# EAGLE design Cockpit-shield (EAGLE 9.5.2)
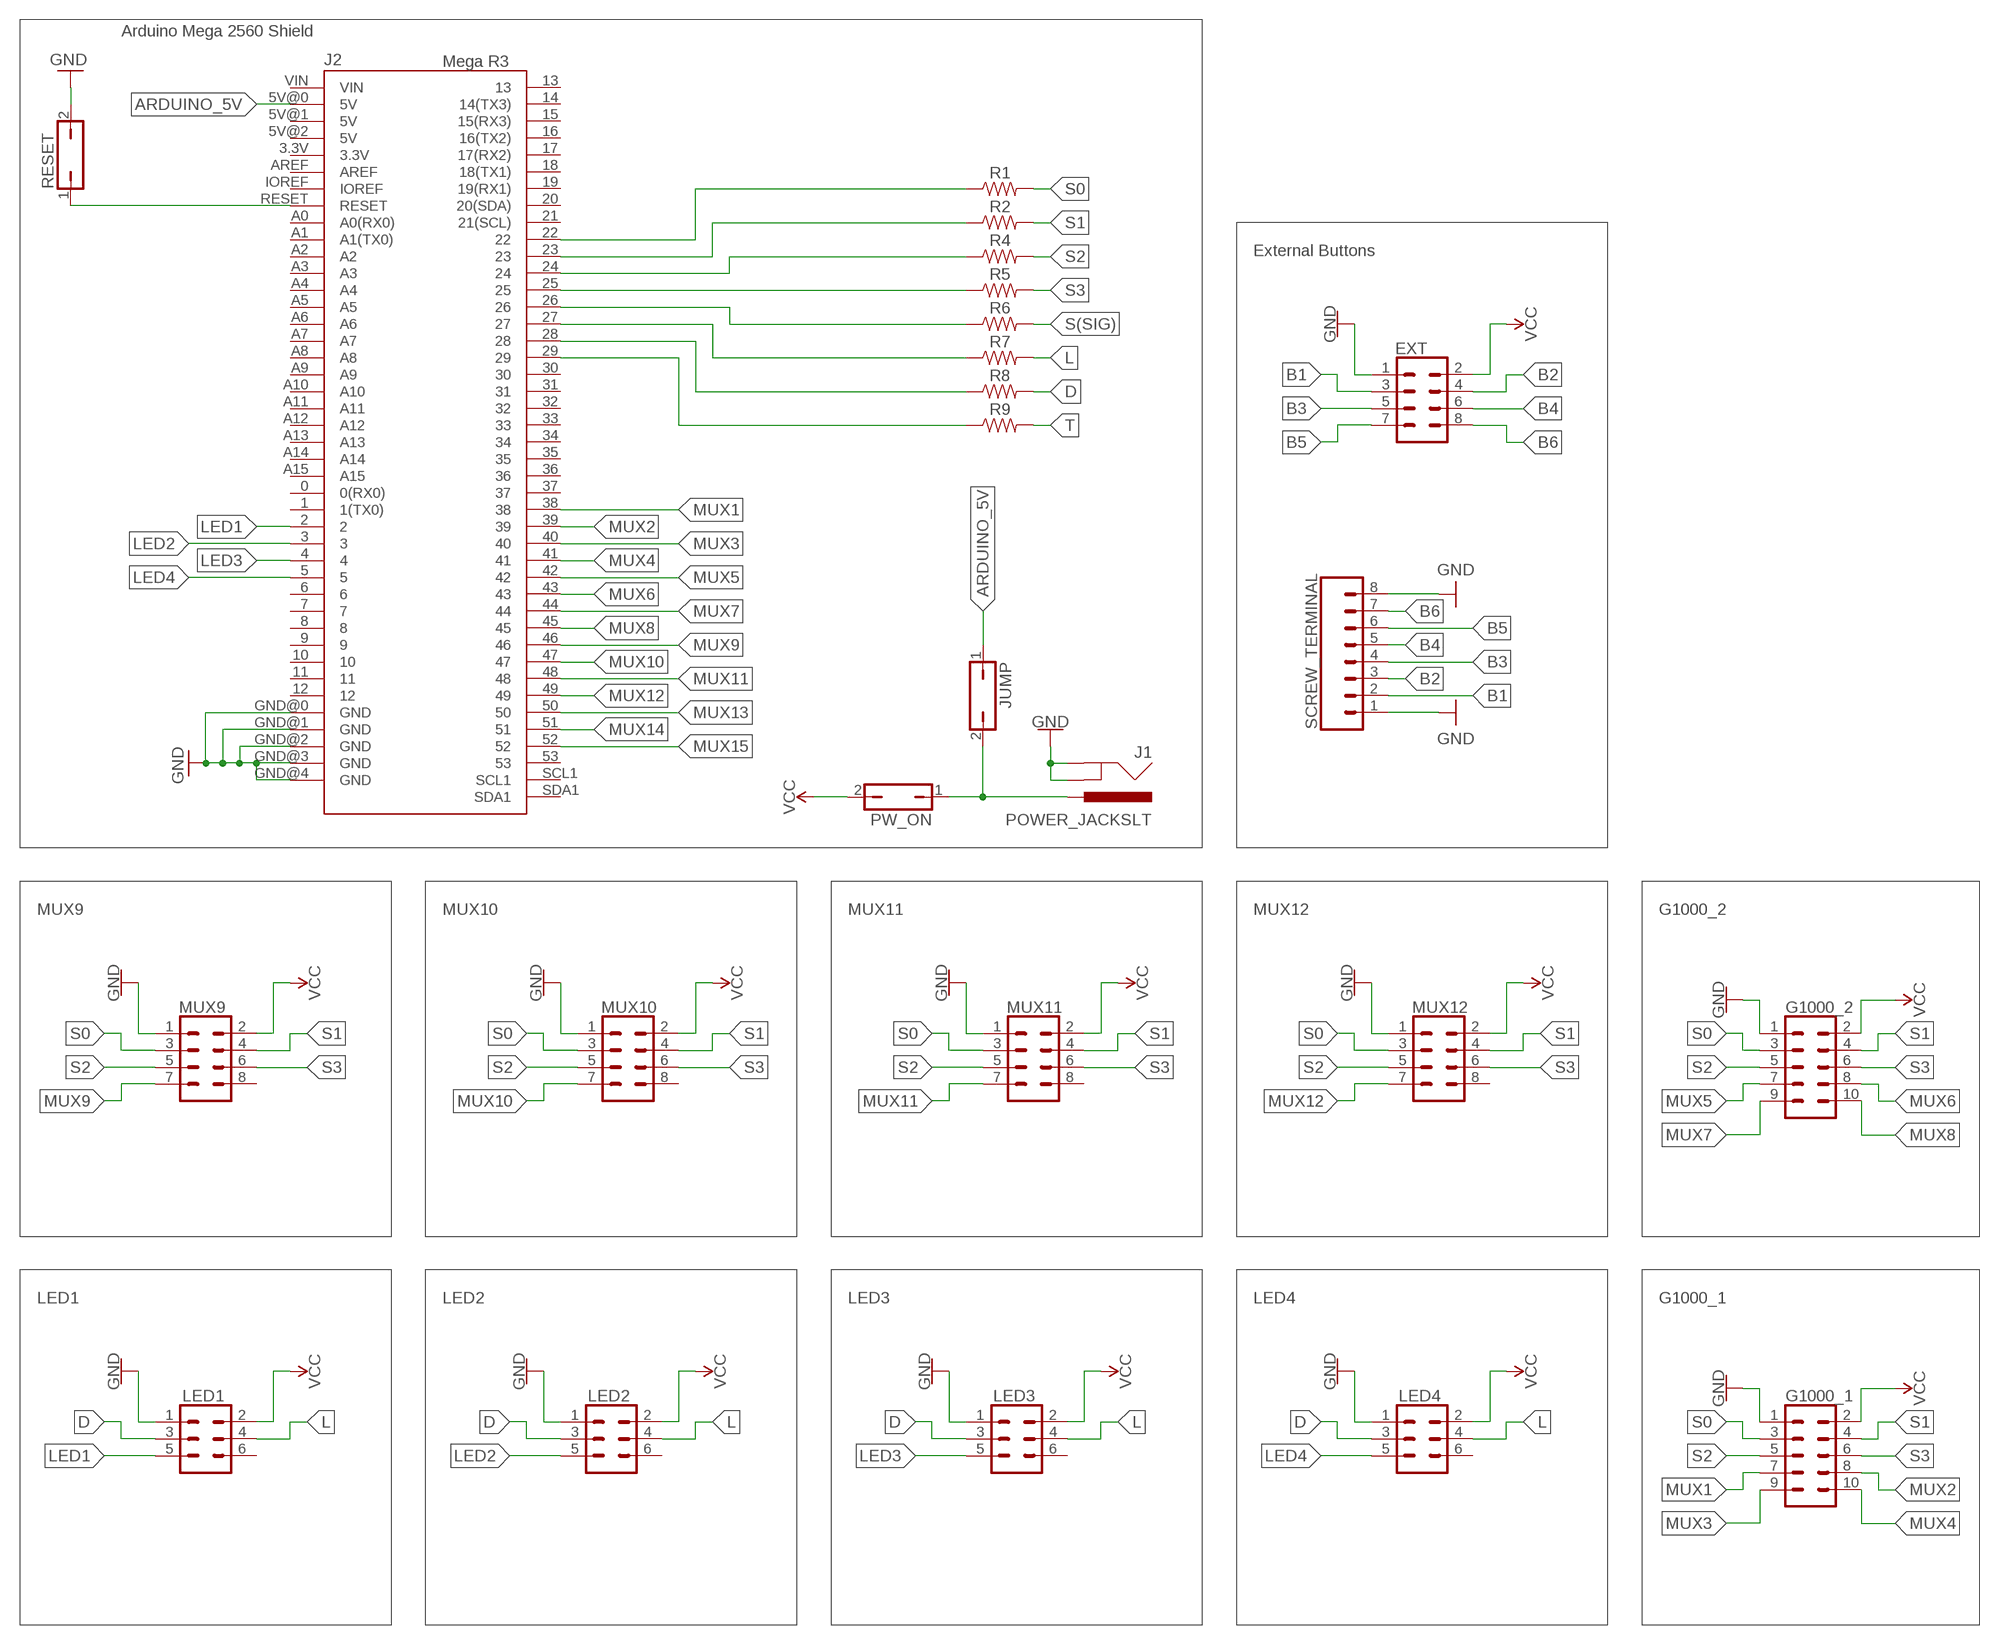
[diagram p0: schematic, sheet 1]

## Parts
EXT  CONN_04X2  [2X4]
G1000_1  CONN_05X2SHD-NS  [2X5-SHROUDED-NS]
G1000_2  CONN_05X2SHD-NS  [2X5-SHROUDED-NS]
J1  POWER_JACKSLT  [POWER_JACK_SLOT]
J2  Mega R3  ARDUINO-MEGAFULL  [ARDUINO_MEGA]
JUMP  JP1Q  [JP1]
LED1  CONN_03X2NO_SILK  [2X3-NS]
LED2  CONN_03X2NO_SILK  [2X3-NS]
LED3  CONN_03X2NO_SILK  [2X3-NS]
LED4  CONN_03X2NO_SILK  [2X3-NS]
MUX9  CONN_04X2  [2X4]
MUX10  CONN_04X2  [2X4]
MUX11  CONN_04X2  [2X4]
MUX12  CONN_04X2  [2X4]
PW_ON  JP1Q  [JP1]
R1  RESISTOR1206  [1206]
R2  RESISTOR1206  [1206]
R4  RESISTOR1206  [1206]
R5  RESISTOR1206  [1206]
R6  RESISTOR1206  [1206]
R7  RESISTOR1206  [1206]
R8  RESISTOR1206  [1206]
R9  RESISTOR1206  [1206]
RESET  JP1Q  [JP1]
SCREW_TERMINAL  CONN_083.5MM-8  [SCREWTERMINAL-3.5MM-8]

## Nets
ARDUINO_5V: J2.5V@0(5V) JUMP.1
B1: EXT.3 SCREW_TERMINAL.2
B2: EXT.4 SCREW_TERMINAL.3
B3: EXT.5 SCREW_TERMINAL.4
B4: EXT.6 SCREW_TERMINAL.5
B5: EXT.7 SCREW_TERMINAL.6
B6: EXT.8 SCREW_TERMINAL.7
D: LED1.3 LED2.3 LED3.3 LED4.3 R8.2
GND: EXT.1 G1000_1.1 G1000_2.1 J1.GND@1(GNDBREAK) J1.GND@2(GND) J2.GND@0(GND) J2.GND@1(GND) J2.GND@2(GND) J2.GND@3(GND) J2.GND@4(GND) LED1.1 LED2.1 LED3.1 LED4.1 MUX9.1 MUX10.1 MUX11.1 MUX12.1 RESET.2 SCREW_TERMINAL.1 SCREW_TERMINAL.8
L: LED1.4 LED2.4 LED3.4 LED4.4 R7.2
LED1: J2.2 LED1.5
LED2: J2.3 LED2.5
LED3: J2.4 LED3.5
LED4: J2.5 LED4.5
MUX1: G1000_1.7 J2.38
MUX2: G1000_1.8 J2.39
MUX3: G1000_1.9 J2.40
MUX4: G1000_1.10 J2.41
MUX5: G1000_2.7 J2.42
MUX6: G1000_2.8 J2.43
MUX7: G1000_2.9 J2.44
MUX8: G1000_2.10 J2.45
MUX9: J2.46 MUX9.7
MUX10: J2.47 MUX10.7
MUX11: J2.48 MUX11.7
MUX12: J2.49 MUX12.7
MUX13: J2.50
MUX14: J2.51
MUX15: J2.52
N$1: J2.22 R1.1
N$2: J2.23 R2.1
N$3: J2.24 R4.1
N$4: J2.25 R5.1
N$5: J2.26 R6.1
N$6: J2.27 R7.1
N$7: J2.28 R8.1
N$8: J2.29 R9.1
N$10: J1.PWR JUMP.2 PW_ON.1
RESET: J2.RESET RESET.1
S0: G1000_1.3 G1000_2.3 MUX9.3 MUX10.3 MUX11.3 MUX12.3 R1.2
S1: G1000_1.4 G1000_2.4 MUX9.4 MUX10.4 MUX11.4 MUX12.4 R2.2
S2: G1000_1.5 G1000_2.5 MUX9.5 MUX10.5 MUX11.5 MUX12.5 R4.2
S3: G1000_1.6 G1000_2.6 MUX9.6 MUX10.6 MUX11.6 MUX12.6 R5.2
S(SIG): R6.2
T: R9.2
VCC: EXT.2 G1000_1.2 G1000_2.2 LED1.2 LED2.2 LED3.2 LED4.2 MUX9.2 MUX10.2 MUX11.2 MUX12.2 PW_ON.2
Unconnected: J2.0(0(RX0)) J2.1(1(TX0)) J2.3.3V J2.5V@1(5V) J2.5V@2(5V) J2.6 J2.7 J2.8 J2.9 J2.10 J2.11 J2.12 J2.13 J2.14(14(TX3)) J2.15(15(RX3)) J2.16(16(TX2)) J2.17(17(RX2)) J2.18(18(TX1)) J2.19(19(RX1)) J2.20(20(SDA)) J2.21(21(SCL)) J2.30 J2.31 J2.32 J2.33 J2.34 J2.35 J2.36 J2.37 J2.53 J2.A0(A0(RX0)) J2.A1(A1(TX0)) J2.A2 J2.A3 J2.A4 J2.A5 J2.A6 J2.A7 J2.A8 J2.A9 J2.A10 J2.A11 J2.A12 J2.A13 J2.A14 J2.A15 J2.AREF J2.IOREF J2.SCL1 J2.SDA1 J2.VIN LED1.6 LED2.6 LED3.6 LED4.6 MUX9.8 MUX10.8 MUX11.8 MUX12.8

## Notes on the sheet
- Arduino Mega 2560 Shield
- External Buttons
- MUX9 | MUX10 | MUX11 | MUX12 | G1000_2
- LED1 | LED2 | LED3 | LED4 | G1000_1

## Library data of the parts
EXT MUX9-MUX12 = SparkFun-Connectors:CONN_04X2: Multi connection point. Often used as Generic Header-pin footprint for 0.1 inch spaced/style header connections On any of the 0.1 inch spaced packages, you can populate with these: Break Away Headers - Straight <https://www.sparkfun.com/products/116> (PRT-00116) Break Away Male Headers - Right Angle <https://www.sparkfun.com/products/553> (PRT-00553) Female Headers <https://www.sparkfun.com/products/115> (PRT-00115) Break Away Headers - Machine Pin <https://www.sparkfun.com/products/117> (PRT-00117) Break Away Female Headers - Swiss Machine Pin <https://www.sparkfun.com/products/743> (PRT-00743)
G1000_1 G1000_2 = SparkFun-Connectors:CONN_05X2: Multi connection point. Often used as Generic Header-pin footprint for 0.1 inch spaced/style header connections For AVR SPI programming port, see special device with nice symbol: "AVR_SPI_PROG_5x2.dev" You can populate with any combo of single row headers, but if you'd like an exact match, check these: 2x5 AVR ICSP Male Header <https://www.sparkfun.com/products/778> (PRT-00778) 2x5 Pin Shrouded Header <https://www.sparkfun.com/products/8506> (PRT-08506) On any of the 0.1 inch spaced packages, you can populate with these: Break Away Headers - Straight <https://www.sparkfun.com/products/116> (PRT-00116) Break Away Male Headers - Right Angle <https://www.sparkfun.com/products/553> (PRT-00553) Female Headers <https://www.sparkfun.com/products/115> (PRT-00115) Break Away Headers - Machine Pin <https://www.sparkfun.com/products/117> (PRT-00117) Break Away Female Headers - Swiss Machine Pin <https://www.sparkfun.com/products/743> (PRT-00743) Special note: the shrouded connector mates well with our 5x2 ribbon cables: 2x5 Pin IDC Ribbon Cable <https://www.sparkfun.com/products/8535> (PRT-08535); PROD_ID: CONN-08671; SF_ID: PRT-08506
J1 = SparkFun-Connectors:POWER_JACK: Power Jack Connector This is the standard 5.5mm barrel jack for power. The PTH is the most common, proven, reliable, footprint. The Slot footprint only works if the mill layer is transmitted to the PCB fab house so be warned. Here are the connectors we sell at SparkFun: DC Barrel Power Jack/Connector <https://www.sparkfun.com/products/119> (PRT-00119) DC Barrel Power Jack/Connector (SMD) <https://www.sparkfun.com/products/12748> (PRT-12748) DC Barrel Jack Adapter - Breadboard Compatible <https://www.sparkfun.com/products/10811> (PRT-10811) It is used on this SparkFun product (and many, many others): SparkFun RedBoard - Programmed with Arduino <https://www.sparkfun.com/products/12757> (DEV-12757) Also, if you need a mating power supply or connector, please check these out: Wall Adapter Power Supply - 9VDC 650mA <https://www.sparkfun.com/products/298> (TOL-00298) DC Barrel Jack Adapter - Male <https://www.sparkfun.com/products/10287> (PRT-10287); PROD_ID: PRT-00119
J2 = zortness:ARDUINO-MEGA: Arduino MegaR3 board footprint. Also works for Due.
JUMP PW_ON RESET = jumper:JP1Q: JUMPER
LED1-LED4 = SparkFun-Connectors:CONN_03X2: Multi connection point. Often used as Generic Header-pin footprint for 0.1 inch spaced/style header connections You can populate with any combo of single row headers, but if you'd like an exact match, check these: Header - 2x3 (Male, 0.1") <https://www.sparkfun.com/products/12807> (PRT-12807) Header - 2x3 (Female, 0.1") <https://www.sparkfun.com/products/13010> (PRT-13010) 2x3 Pin Shrouded Header <https://www.sparkfun.com/products/10877> (PRT-10877) On any of the 0.1 inch spaced packages, you can populate with these: Break Away Headers - Straight <https://www.sparkfun.com/products/116> (PRT-00116) Break Away Male Headers - Right Angle <https://www.sparkfun.com/products/553> (PRT-00553) Female Headers <https://www.sparkfun.com/products/115> (PRT-00115) Break Away Headers - Machine Pin <https://www.sparkfun.com/products/117> (PRT-00117) Break Away Female Headers - Swiss Machine Pin <https://www.sparkfun.com/products/743> (PRT-00743) Special note: the shrouded connector mates well with our 3x2 ribbon cables: Ribbon Crimp Connector - 6-pin (2x3, Female) <https://www.sparkfun.com/products/10651> (PRT-10651) Ribbon Cable - 6 wire (15ft) <https://www.sparkfun.com/products/10646> (PRT-10646)
R1 R2 R4-R9 = SparkFun-Resistors:RESISTOR: Generic Resistor Package
SCREW_TERMINAL = SparkFun-Connectors:CONN_08: Multi connection point. Often used as Generic Header-pin footprint for 0.1 inch spaced/style header connections On any of the 0.1 inch spaced packages, you can populate with these: Break Away Headers - Straight <https://www.sparkfun.com/products/116> (PRT-00116) Break Away Male Headers - Right Angle <https://www.sparkfun.com/products/553> (PRT-00553) Female Headers <https://www.sparkfun.com/products/115> (PRT-00115) Break Away Headers - Machine Pin <https://www.sparkfun.com/products/117> (PRT-00117) Break Away Female Headers - Swiss Machine Pin <https://www.sparkfun.com/products/743> (PRT-00743) Arduino Stackable Header - 8 Pin <https://www.sparkfun.com/products/9279> (PRT-09279) For SCREWTERMINALS and SPRING TERMINALS visit here: Screw Terimnals on SparkFun.com <https://www.sparkfun.com/search/results?term=Screw+Terminals> (5mm/3.5mm/2.54mm spacing) This device is also useful as a general connection point to wire up your design to another part of your project. Our various solder wires solder well into these plated through hole pads. Hook-Up Wire - Assortment (Stranded, 22 AWG) <https://www.sparkfun.com/products/11375> (PRT-11375) Hook-Up Wire - Assortment (Solid Core, 22 AWG) <https://www.sparkfun.com/products/11367> (PRT-11367) View the entire wire category on our website here <https://www.sparkfun.com/categories/141> Special notes: Molex polarized connector foot print use with SKU : PRT-08231 with associated crimp pins and housings. 1MM SMD Version SKU: PRT-10208 NOTES ON THE VARIANTS LOCK and LOCK_LONGPADS... This footprint was designed to help hold the alignment of a through-hole component (i.e. 6-pin header) while soldering it into place. You may notice that each hole has been shifted either up or down by 0.005 of an inch from it's more standard position (which is a perfectly straight line). This slight alteration caused the pins (the squares in the middle) to touch the edges of the holes. Because they are alternating, it causes a "brace" to hold the component in place. 0.005 has proven to be the perfect amount of "off-center" position when using our standard breakaway headers. Although looks a little odd when you look at the bare footprint, once you have a header in there, the alteration is very hard to notice. Also,if you push a header all the way into place, it is covered up entirely on the bottom side.

## Net classes
0 default: clearance 0.205 mm
1 pwr: width 0.305 mm
2 raw: width 0.305 mm

## Board
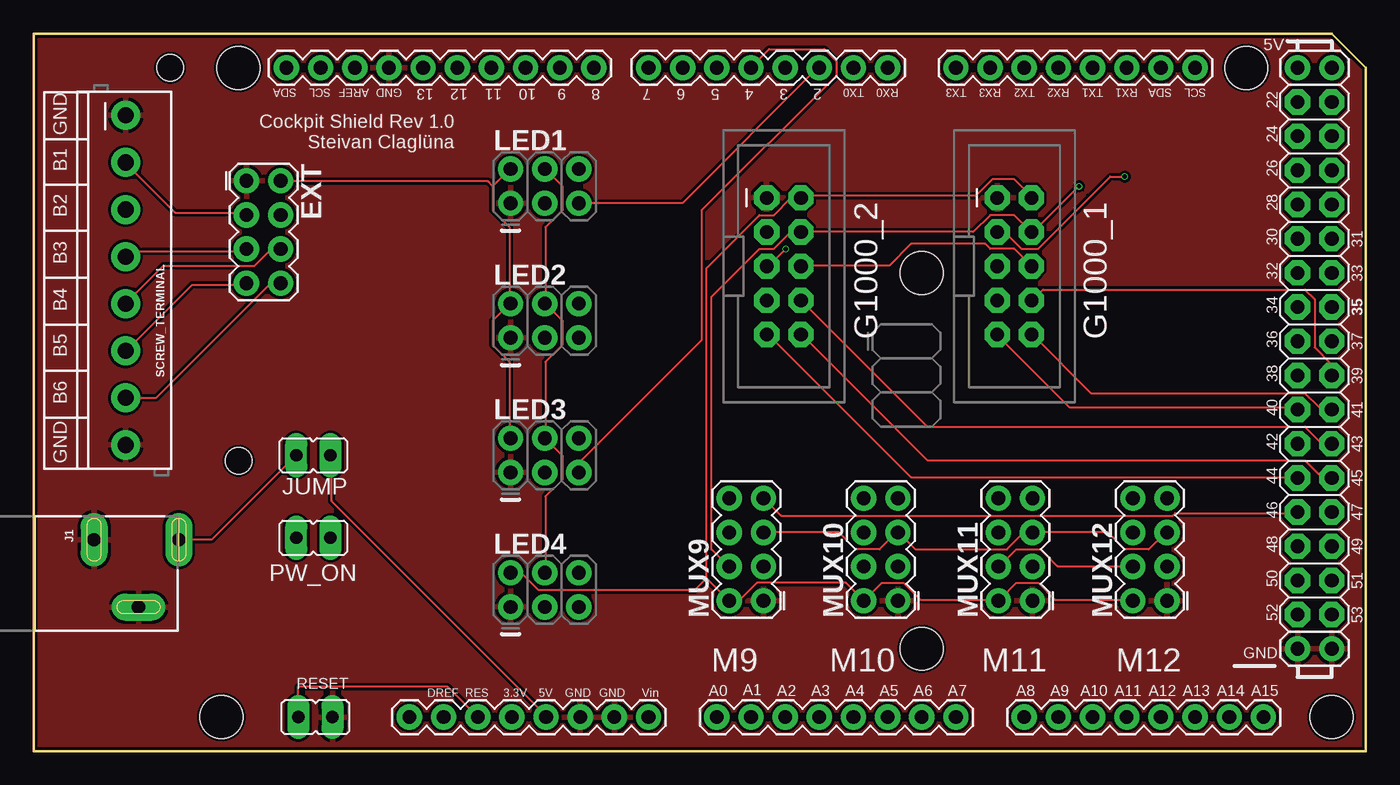
[diagram p1: board, top side]
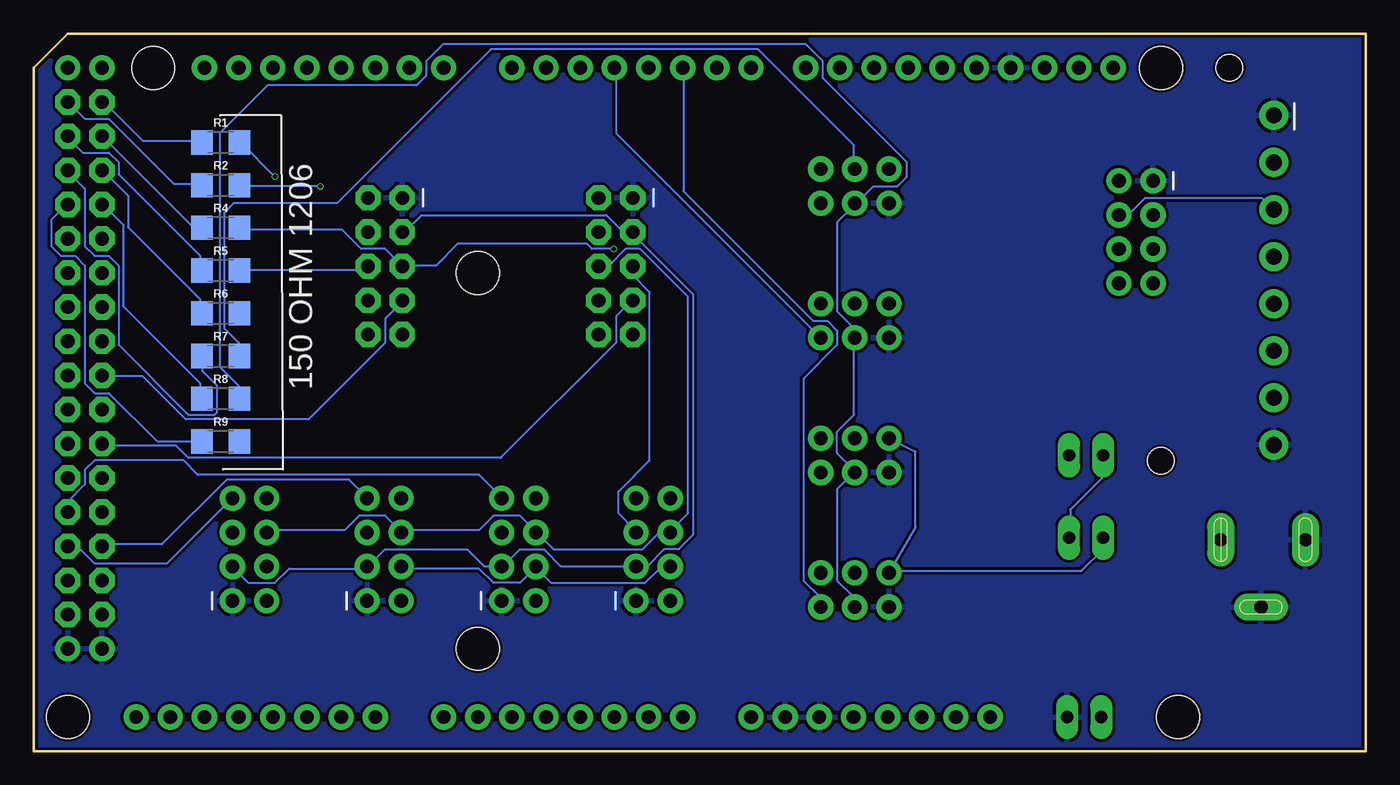
[diagram p2: board, bottom side, seen from below]

Size 99.06 x 53.34 mm. Coordinates in mm from the lower left corner, seen from the top.
Copper layers (1*16): Top 0.035mm / dielectric 1.6mm / Bottom 0.035mm
Design rules "jlcpcb-2layers": minimum track width 5mil, minimum drill 0.3mm, track to track 5mil, track to pad 5mil, pad to pad 5mil, via to via 5mil, smd to smd 5mil, copper to edge 0.2mm, drill to drill 6mil, minimum pad ring 10mil, minimum via ring 3mil, stop-mask expansion 4mil, vias tented up to drill 0mil, thermal gap 10mil
Holes 2 mm at 10.16,50.8 15.24,21.59

### Footprints (pad centres in the part's own frame; a part is rotated, then mirrored left to right if it is on the bottom)
2X4 = drill 1.016 pad 1.88: 1 -3.81,-1.27; 2 -3.81,1.27; 3 -1.27,-1.27; 4 -1.27,1.27; 5 1.27,-1.27; 6 1.27,1.27; 7 3.81,-1.27; 8 3.81,1.27
2X5-SHROUDED-NS = drill 1.016 pad 1.88 octagon: 1 -1.27,5.08; 2 1.27,5.08; 3 -1.27,2.54; 4 1.27,2.54; 5 -1.27,0; 6 1.27,0; 7 -1.27,-2.54; 8 1.27,-2.54; 9 -1.27,-5.08; 10 1.27,-5.08
POWER_JACK_SLOT = drill 1 pad 2 long: GND@1 2.58,7.5; GND@2 7.58,10.8; PWR 2.58,13.8
ARDUINO_MEGA = drill 1.016 pad 1.88: 0 63.5,50.8; 1 60.96,50.8; 2 58.42,50.8; 3 55.88,50.8; 3.3V 35.56,2.54; 4 53.34,50.8; 5 50.8,50.8; 5V@0 38.1,2.54; 5V@1 93.98,50.8; 5V@2 96.52,50.8; 6 48.26,50.8; 7 45.72,50.8; 8 41.656,50.8; 9 39.116,50.8; 10 36.576,50.8; 11 34.036,50.8; 12 31.496,50.8; 13 28.956,50.8; 14 68.58,50.8; 15 71.12,50.8; 16 73.66,50.8; 17 76.2,50.8; 18 78.74,50.8; 19 81.28,50.8; 20 83.82,50.8; 21 86.36,50.8; A0 50.8,2.54; A1 53.34,2.54; A2 55.88,2.54; A3 58.42,2.54; A4 60.96,2.54; A5 63.5,2.54; A6 66.04,2.54; A7 68.58,2.54; A8 73.66,2.54; A9 76.2,2.54; A10 78.74,2.54; A11 81.28,2.54; A12 83.82,2.54; A13 86.36,2.54; A14 88.9,2.54; A15 91.44,2.54; AREF 23.876,50.8; EMPTY 27.94,2.54; GND@0 40.64,2.54; GND@1 43.18,2.54; GND@2 93.98,7.62; GND@3 96.52,7.62; GND@4 26.416,50.8; IOREF 30.48,2.54; RESET 33.02,2.54; SCL1 21.336,50.8; SDA1 18.796,50.8; VIN 45.72,2.54 | drill 1.016 pad 1.88 octagon: 22 93.98,48.26; 23 96.52,48.26; 24 93.98,45.72; 25 96.52,45.72; 26 93.98,43.18; 27 96.52,43.18; 28 93.98,40.64; 29 96.52,40.64; 30 93.98,38.1; 31 96.52,38.1; 32 93.98,35.56; 33 96.52,35.56; 34 93.98,33.02; 35 96.52,33.02; 36 93.98,30.48; 37 96.52,30.48; 38 93.98,27.94; 39 96.52,27.94; 40 93.98,25.4; 41 96.52,25.4; 42 93.98,22.86; 43 96.52,22.86; 44 93.98,20.32; 45 96.52,20.32; 46 93.98,17.78; 47 96.52,17.78; 48 93.98,15.24; 49 96.52,15.24; 50 93.98,12.7; 51 96.52,12.7; 52 93.98,10.16; 53 96.52,10.16 | hole 3.2: 15.24,50.8; 13.97,2.54; 66.04,35.56; 66.04,7.62; 90.17,50.8; 96.52,2.54
JP1 = drill 0.914 long: 1 0,-1.27; 2 0,1.27
2X3-NS = drill 1.016 pad 1.88: 1 -2.54,-1.27; 2 -2.54,1.27; 3 0,-1.27; 4 0,1.27; 5 2.54,-1.27; 6 2.54,1.27
1206 = smd 1.6 x 1.8: 1 -1.4,0; 2 1.4,0
SCREWTERMINAL-3.5MM-8 = drill 1.2 pad 2.032: 1 0,0; 2 3.5,0; 3 7,0; 4 10.5,0; 5 14,0; 6 17.5,0; 7 21,0; 8 24.5,0

### Placement (x,y rotation side)
EXT  17.1,38.6 270 top
G1000_1  72.92,36.05 0 top
G1000_2  55.78,36.05 0 top
J1  -3,18.3 270 top
J2  0,0 0 top
JUMP  20.8,22 90 top
LED1  38,42 0 top
LED2  38,32 0 top
LED3  38,22 0 top
LED4  38,12 0 top
MUX9  53,15 90 top
MUX10  63,15 90 top
MUX11  73,15 90 top
MUX12  83,15 90 top
PW_ON  20.8,15.88 90 top
R1  85.16,45.26 0 bottom
R2  85.16,42.08 0 bottom
R4  85.16,38.91 0 bottom
R5  85.16,35.73 0 bottom
R6  85.16,32.55 0 bottom
R7  85.16,29.38 0 bottom
R8  85.16,26.2 0 bottom
R9  85.16,23.03 0 bottom
RESET  20.95,2.54 270 top
SCREW_TERMINAL  6.84,47.26 270 top

### Tracks (layer width: path | path; a pad name or v marks a point on that pad's centre or on a via)
ARDUINO_5V
  Top 0.152: JUMP.1 22.16,21.98 22.16,18.59 38.06,2.68 J2.5V@0
B1
  Top 0.152: EXT.3 15.73,40.03 10.54,40.03 6.97,43.6 SCREW_TERMINAL.2
B2
  Bottom 0.152: EXT.4 18.23,40.03 17.51,40.03 16.44,41.1 7.68,41.1 6.97,40.39 SCREW_TERMINAL.3
B3
  Top 0.152: EXT.5 15.73,37.17 7.33,37.17 6.97,36.81 SCREW_TERMINAL.4
B4
  Top 0.152: EXT.6 18.23,37.17 17.51,37.17 16.44,36.1 9.65,36.1 6.97,33.42 SCREW_TERMINAL.5
B5
  Top 0.152: EXT.7 15.73,34.67 11.79,34.67 6.97,29.84 SCREW_TERMINAL.6
B6
  Top 0.152: EXT.8 18.23,34.67 17.51,34.67 9.11,26.27 6.97,26.27 SCREW_TERMINAL.7
D
  Bottom 0.152: LED4.3 38.06,10.9 38.06,11.44 39.31,12.69 39.31,19.48 38.06,20.73 LED3.3 38.06,20.91 39.31,22.16 39.31,23.77 38.06,25.02 38.06,30.56 LED2.3 38.06,30.74 38.06,31.45 39.31,32.7 39.31,39.31 38.06,40.56 LED1.3 37.88,40.74 36.63,41.99 34.85,41.99 34.13,42.71 34.13,43.78 40.39,50.04 40.39,51.29 41.64,52.54 68.62,52.54 69.87,51.29 69.87,50.22 70.59,49.5 81.67,49.5 85.24,45.93 85.24,28.59 83.81,27.16 83.81,26.27 R8.2
GND
  pour Bottom: 0,53.34 0,0 99.6,0 99.6,53.34
  pour Top: -0.64,53.34 0,0 99.4,0 99.4,53.34
L
  Top 0.152: LED4.4 38.06,13.4 38.06,18.94 39.31,20.19 39.31,21.98 38.06,23.23 LED3.4 38.06,23.41 38.06,28.95 39.31,30.2 39.31,31.99 38.06,33.24 LED2.4 38.06,33.42 38.06,38.96 39.31,40.21 39.31,41.99 38.06,43.24 LED1.4
  Bottom 0.152: R7.2 83.81,29.48 83.81,30.38 84.88,31.45 84.88,40.03 84.17,40.74 76.48,40.74 65.05,52.18 45.21,52.18 38.06,45.03 38.06,43.42 LED1.4
LED1
  Top 0.152: LED1.5 40.56,40.74 48.25,40.74 58.26,50.75 J2.2
LED2
  Bottom 0.152: LED2.5 40.56,30.74 55.75,45.93 55.75,50.75 J2.3
LED3
  Top 0.152: LED3.5 40.56,20.91 40.56,21.44 49.68,30.56 49.68,40.21 59.69,50.22 59.69,51.29 58.79,52.18 54.68,52.18 53.43,50.93 J2.4
LED4
  Bottom 0.152: LED4.5 40.56,10.9 40.56,11.44 41.82,12.69 41.82,27.7 39.31,30.2 39.31,31.27 40.03,31.99 41.1,31.99 50.75,41.64 50.75,50.75 J2.5
MUX1
  Bottom 0.152: J2.38 93.82,27.88 90.96,27.88 87.74,24.66 78.63,24.66 72.91,30.38 72.91,32.17 71.66,33.42 G1000_1.7
MUX2
  Top 0.152: J2.39 96.5,28.06 96.5,28.77 95.25,30.02 95.25,33.6 94.53,34.31 75.05,34.31 74.34,33.6 G1000_1.8
MUX3
  Top 0.152: J2.40 93.82,25.55 77.02,25.55 71.66,30.91 G1000_1.9
MUX4
  Top 0.152: J2.41 96.5,25.55 95.61,25.55 94.53,26.63 78.63,26.63 74.34,30.91 G1000_1.10
MUX5
  Bottom 0.152: J2.42 93.82,22.7 88.46,22.7 87.56,21.8 64.33,21.8 55.75,30.38 55.75,32.34 54.68,33.42 G1000_2.7
MUX6
  Top 0.152: J2.43 96.5,22.87 95.78,22.87 94.53,24.12 66.48,24.12 57.18,33.42 G1000_2.8
MUX7
  Top 0.152: J2.44 93.82,20.37 65.22,20.37 54.68,30.91 G1000_2.9
MUX8
  Top 0.152: J2.45 96.5,20.37 95.78,20.37 94.53,21.62 66.48,21.62 57.18,30.91 G1000_2.10
MUX9
  Top 0.152: J2.46 93.82,17.69 84.88,17.69 84.7,17.51 55.58,17.51 54.33,18.76 MUX9.7
MUX10
  Bottom 0.152: J2.47 96.5,17.87 96.5,18.59 95.25,19.84 95.25,20.91 94.53,21.62 87.92,21.62 86.85,20.55 65.94,20.55 64.33,18.94 MUX10.7
MUX11
  Bottom 0.152: J2.48 93.82,15.37 89.53,15.37 84.7,20.19 75.59,20.19 74.34,18.94 MUX11.7
MUX12
  Bottom 0.152: J2.49 96.5,15.19 95.78,15.19 94.53,13.94 89.17,13.94 84.35,18.76 MUX12.7
N$1
  Bottom 0.152: R1.1 86.67,45.39 90.96,45.39 93.82,48.25 J2.22
N$2
  Bottom 0.152: R2.1 86.67,42.17 88.64,42.17 93.46,47 95.25,47 96.5,48.25 J2.23
N$3
  Bottom 0.152: R4.1 86.67,38.96 87.21,38.96 93.82,45.57 J2.24
N$4
  Bottom 0.152: R5.1 86.67,35.74 86.67,36.81 92.75,42.89 92.75,43.78 93.46,44.5 95.43,44.5 96.5,45.57 J2.25
N$5
  Bottom 0.152: R6.1 86.67,32.7 86.67,33.6 92.03,38.96 92.03,41.28 93.82,43.07 J2.26
N$6
  Bottom 0.152: R7.1 86.49,29.31 86.49,28.23 85.42,27.16 85.42,25.2 85.6,25.02 87.56,25.02 92.75,30.2 92.75,36.1 93.46,36.81 94.53,36.81 95.25,37.53 95.25,41.82 96.5,43.07 J2.27
N$7
  Bottom 0.152: R8.1 86.67,26.27 86.67,27.34 92.39,33.06 92.39,39.13 93.82,40.56 J2.28
N$8
  Bottom 0.152: R9.1 86.67,23.05 89.89,23.05 93.46,26.63 94.53,26.63 95.25,27.34 95.25,36.1 95.96,36.81 97.03,36.81 97.75,37.53 97.75,39.49 96.68,40.56 J2.29
N$10
  Top 0.152: J1.PWR 10.9,15.73 13.22,15.73 19.48,21.98 JUMP.2
  Bottom 0.152: JUMP.2 19.53,20.41 21.98,17.96 21.98,15.9 PW_ON.1
RESET
  Top 0.152: RESET.1 19.68,4.79 30.77,4.79 32.88,2.68 J2.RESET
S0  (via drill 0.33)
  Top 0.152: v81.13,42.71 80.06,42.71 74.7,37.35 73.45,37.35 72.37,38.42 71.66,38.42 G1000_1.3
  Bottom 0.152: MUX12.3 84.17,13.58 83.1,12.51 81.13,12.51 80.06,13.58 74.34,13.58 MUX11.3 74.16,13.76 72.91,15.01 66.83,15.01 65.58,13.76 64.33,13.76 MUX10.3 64.15,13.76 62.9,15.01 61.12,15.01 59.86,13.76 54.33,13.76 MUX9.3 54.15,13.76 53.43,13.76 52.18,15.01 51.11,15.01 50.04,16.08 50.04,33.95 54.5,38.42 G1000_2.3 54.68,38.6 55.22,38.6 56.47,39.85 70.23,39.85 71.48,38.6 G1000_1.3 | v81.13,42.71 83.63,45.21 R1.2
S1  (via drill 0.33)
  Top 0.152: v77.73,41.99 74.34,38.6 G1000_1.4 74.16,38.6 72.91,39.85 71.12,39.85 69.87,38.6 57.18,38.6 G1000_2.4 57.01,38.42 56.11,38.42 55.04,37.35 53.97,37.35 50.39,33.77 50.39,15.01 51.64,13.76 MUX9.4 | MUX12.4 81.67,13.76 76.13,13.76 74.88,15.01 73.09,15.01 71.84,13.76 MUX11.4
  Bottom 0.152: v77.73,41.99 83.63,41.99 R2.2 | MUX9.4 51.82,13.58 52.54,13.58 53.61,12.51 60.58,12.51 61.65,13.58 MUX10.4 61.83,13.58 62.9,12.51 64.87,12.51 65.94,13.58 71.66,13.58 MUX11.4
S2  (via drill 0.33)
  Top 0.152: MUX12.5 84.17,16.26 82.92,15.01 81.13,15.01 79.88,16.26 74.34,16.26 MUX11.5 74.16,16.26 73.62,16.26 72.37,15.01 65.58,15.01 64.33,16.26 MUX10.5 64.15,16.26 62.9,15.01 61.12,15.01 59.86,16.26 54.33,16.26 MUX9.5 | v55.93,37.35 54.68,36.1 G1000_2.5
  Bottom 0.152: R4.2 83.63,38.78 76.13,38.78 74.7,37.35 72.91,37.35 71.66,36.1 G1000_1.5 71.48,36.1 69.14,36.1 67.53,37.71 57.9,37.71 57.54,37.35 v55.93,37.35 | G1000_2.5 54.5,35.92 54.5,35.38 53.25,34.13 53.25,21.62 55.58,19.3 55.58,17.69 54.33,16.44 MUX9.5
S3
  Top 0.152: G1000_2.6 57.18,36.1 63.62,36.1 65.22,37.71 70.77,37.71 71.12,37.35 72.91,37.35 74.16,36.1 G1000_1.6
  Bottom 0.152: R5.2 83.63,35.74 74.52,35.74 74.34,35.92 G1000_1.6 | MUX12.6 81.67,16.44 75.95,16.44 74.88,17.51 72.91,17.51 71.84,16.44 MUX11.6 71.66,16.44 65.94,16.44 64.87,17.51 62.9,17.51 61.83,16.44 MUX10.6 61.65,16.26 60.4,15.01 53.79,15.01 52.54,16.26 51.82,16.26 MUX9.6 51.64,16.44 50.39,17.69 50.39,33.77 53.97,37.35 55.04,37.35 56.29,36.1 57.01,36.1 G1000_2.6
VCC
  Top 0.152: 34.13,41.99 34.13,40.21 35.38,38.96 35.38,33.42 LED2.2 35.38,33.24 34.13,31.99 34.13,30.2 35.38,28.95 35.38,23.41 LED3.2 | 34.13,41.99 35.38,43.24 LED1.2 | 34.13,41.99 33.77,42.35 18.41,42.35 EXT.2 | G1000_1.2 74.16,41.28 72.91,42.53 71.3,42.53 70.05,41.28 57.18,41.28 G1000_2.2 57.01,41.1 56.29,41.1 55.04,39.85 53.97,39.85 50.04,35.92 50.04,12.87 | MUX12.2 81.67,11.26 75.95,11.26 74.7,12.51 73.09,12.51 71.84,11.26 MUX11.2 71.66,11.26 65.94,11.26 64.69,12.51 63.08,12.51 61.83,11.26 MUX10.2 61.65,11.26 60.4,12.51 53.79,12.51 52.54,11.26 51.82,11.26 MUX9.2 51.64,11.26 50.04,12.87 | 50.04,12.87 49.14,11.97 37.53,11.97 36.28,13.22 35.56,13.22 LED4.2
  Bottom 0.152: PW_ON.2 19.53,15.01 21.14,13.4 35.38,13.4 35.41,13.35 | 35.41,13.35 33.48,16.66 33.48,22.27 LED3.2 | 35.41,13.35 LED4.2

### Text on the board
tPlace: GND | B1 | B2 | B3 | B4 | B5 | B6 | GND | RESET
tNames: Cockpit Shield Rev 1.0 / Steivan Claglüna | G1000_2 | G1000_1 | M9 | M10 | M11 | M12
bNames: 150 OHM 1206